# Altium schematic sheet TOP.SchDoc
size A; SheetNumber: 1; SheetTotal: 3
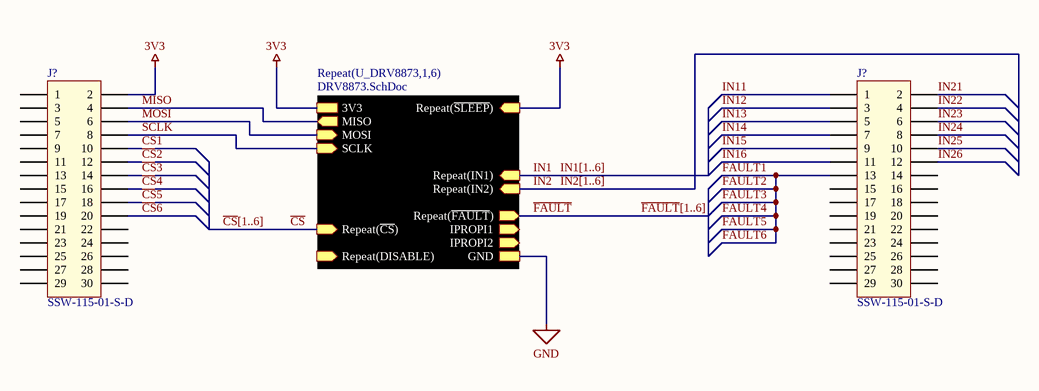
[diagram p0: TOP.SchDoc]

## Parts
(Parts that share a designator on the sheet are numbered #1, #2 ... from top to bottom, then left to right.)
J?#1  SSW-115-01-S-D  [SSW-115-01-S-D]
J?#2  SSW-115-01-S-D  [SSW-115-01-S-D]

## Sub-sheets
Repeat(U_DRV8873,1,6) = DRV8873.SchDoc: GND, 3V3, MISO (out), MOSI (in), SCLK (in), Repeat(~{CS}) (in), Repeat(IN1) (in), Repeat(IN2) (in), Repeat(~{SLEEP}) (in), Repeat(DISABLE) (in), Repeat(~{FAULT}) (out), IPROPI1 (out), IPROPI2 (out)

## Nets
3V3: J?#1.2 ; sheet Repeat(U_DRV8873,1,6)/3V3, sheet Repeat(U_DRV8873,1,6)/Repeat(~{SLEEP})
GND: sheet Repeat(U_DRV8873,1,6)/GND
~{CS}: sheet Repeat(U_DRV8873,1,6)/Repeat(~{CS})
~{CS}1: J?#1.10
~{CS}2: J?#1.12
~{CS}3: J?#1.14
~{CS}4: J?#1.16
~{CS}5: J?#1.18
~{CS}6: J?#1.20
~{FAULT}: sheet Repeat(U_DRV8873,1,6)/Repeat(~{FAULT})
~{FAULT}1: J?#2.13  [also labelled ~{FAULT}2, ~{FAULT}3, ~{FAULT}4, ~{FAULT}5, ~{FAULT}6]
IN1: sheet Repeat(U_DRV8873,1,6)/Repeat(IN1)  [also labelled IN1[1..6]]
IN2: sheet Repeat(U_DRV8873,1,6)/Repeat(IN2)  [also labelled IN2[1..6]]
IN11: J?#2.1
IN12: J?#2.3
IN13: J?#2.5
IN14: J?#2.7
IN15: J?#2.9
IN16: J?#2.11
IN21: J?#2.2
IN22: J?#2.4
IN23: J?#2.6
IN24: J?#2.8
IN25: J?#2.10
IN26: J?#2.12
MISO: J?#1.4 ; sheet Repeat(U_DRV8873,1,6)/MISO
MOSI: J?#1.6 ; sheet Repeat(U_DRV8873,1,6)/MOSI
SCLK: J?#1.8 ; sheet Repeat(U_DRV8873,1,6)/SCLK

Not connected (* = marked no-connect by the designer): J?#1 1 3 5 7 9 11 13 15 17 19 21 22 23 24 25 26 27 28 29 30; J?#2 14 15 16 17 18 19 20 21 22 23 24 25 26 27 28 29 30

## Buses and harness runs
bus ~{CS}[1..6]
bus ~{FAULT}[1..6]

## Library data of the parts
J?#1 J?#2 = CMPL-001-B539-A.1: CONN RCPT 30POS 0.1 GOLD PCB; Manufacturer: Samtec Inc.; Pitch: 0.100" (2.54mm); Number of Positions: 30; Number of Positions Loaded: All; Connector Type: Receptacle; Color: Black; Mounting Type: Through Hole; RoHS Compliance: Yes; Manufacturer Part Number: SSW-115-01-S-D; Supplier 1 Part Number: SAM1210-15-ND; Contact Finish Thickness: 30.0µin (0.76µm); Number of Rows: 2; Termination: Solder; Supplier 1: Digikey; Contact Finish: Gold; Row Spacing: -; Contact Type: Forked